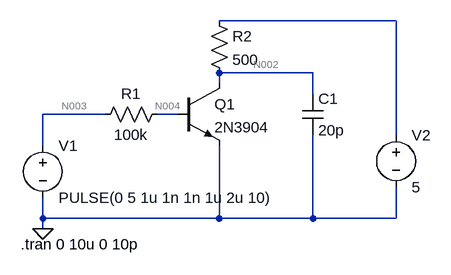
[diagram p0: schematic Draft1.asc]
Draft1.asc, the LTspice schematic file:
Version 4
SHEET 1 880 680
WIRE 576 -64 304 -64
WIRE 448 16 304 16
WIRE 304 32 304 16
WIRE 448 48 448 16
WIRE 128 80 32 80
WIRE 240 80 208 80
WIRE 576 112 576 -64
WIRE 32 128 32 80
WIRE 32 240 32 208
WIRE 304 240 304 128
WIRE 304 240 32 240
WIRE 448 240 448 112
WIRE 448 240 304 240
WIRE 576 240 576 192
WIRE 576 240 448 240
WIRE 32 256 32 240
FLAG 32 256 0
SYMBOL voltage 32 112 R0
WINDOW 123 0 0 Left 0
WINDOW 39 0 0 Left 0
SYMATTR InstName V1
SYMATTR Value PULSE(0 5 1u 1n 1n 1u 2u 10)
SYMBOL res 224 64 R90
WINDOW 0 0 56 VBottom 2
WINDOW 3 32 56 VTop 2
SYMATTR InstName R1
SYMATTR Value 100k
SYMBOL res 288 -80 R0
SYMATTR InstName R2
SYMATTR Value 500
SYMBOL voltage 576 96 R0
WINDOW 123 0 0 Left 0
WINDOW 39 0 0 Left 0
SYMATTR InstName V2
SYMATTR Value 5
SYMBOL npn 240 32 R0
SYMATTR InstName Q1
SYMATTR Value 2N3904
SYMBOL cap 432 48 R0
SYMATTR InstName C1
SYMATTR Value 20p
TEXT -2 280 Left 2 !.tran 0 10u 0 10p

The netlist it stands for:
* Draft1.asc
V1 N003 0 PULSE(0 5 1u 1n 1n 1u 2u 10)
R1 N004 N003 100k
R2 N001 N002 500
V2 N001 0 5
Q1 N002 N004 0 0 2N3904
C1 N002 0 20p
.model NPN NPN
.model PNP PNP
.lib standard.bjt
.tran 0 10u 0 10p
.backanno
.end

* Results of the author's LTspice run, read from the files saved beside the schematic
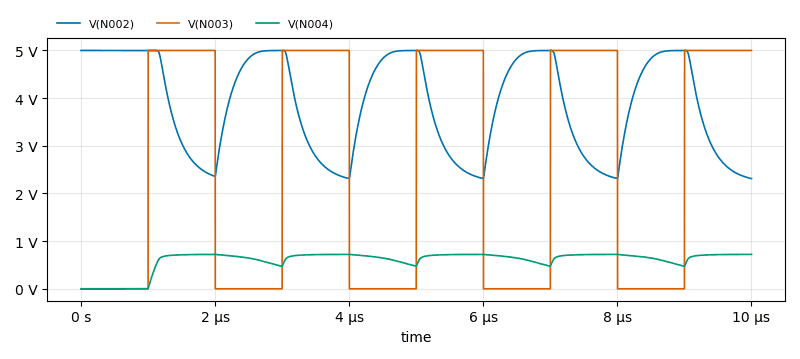
[diagram p1: Transient Analysis of Draft1.asc, plotted from the saved traces]
* Transient Analysis, 1 run:
*   V(N002): min 2.312 V, max 5.002 V, average 3.874 V, rms 4.013 V, last 2.312 V
*   V(N003): min 0 V, max 5 V, average 2.502 V, rms 3.536 V, last 5 V
*   V(N004): min 500.2 nV, max 722.3 mV, average 596.1 mV, rms 633.4 mV, last 722.3 mV